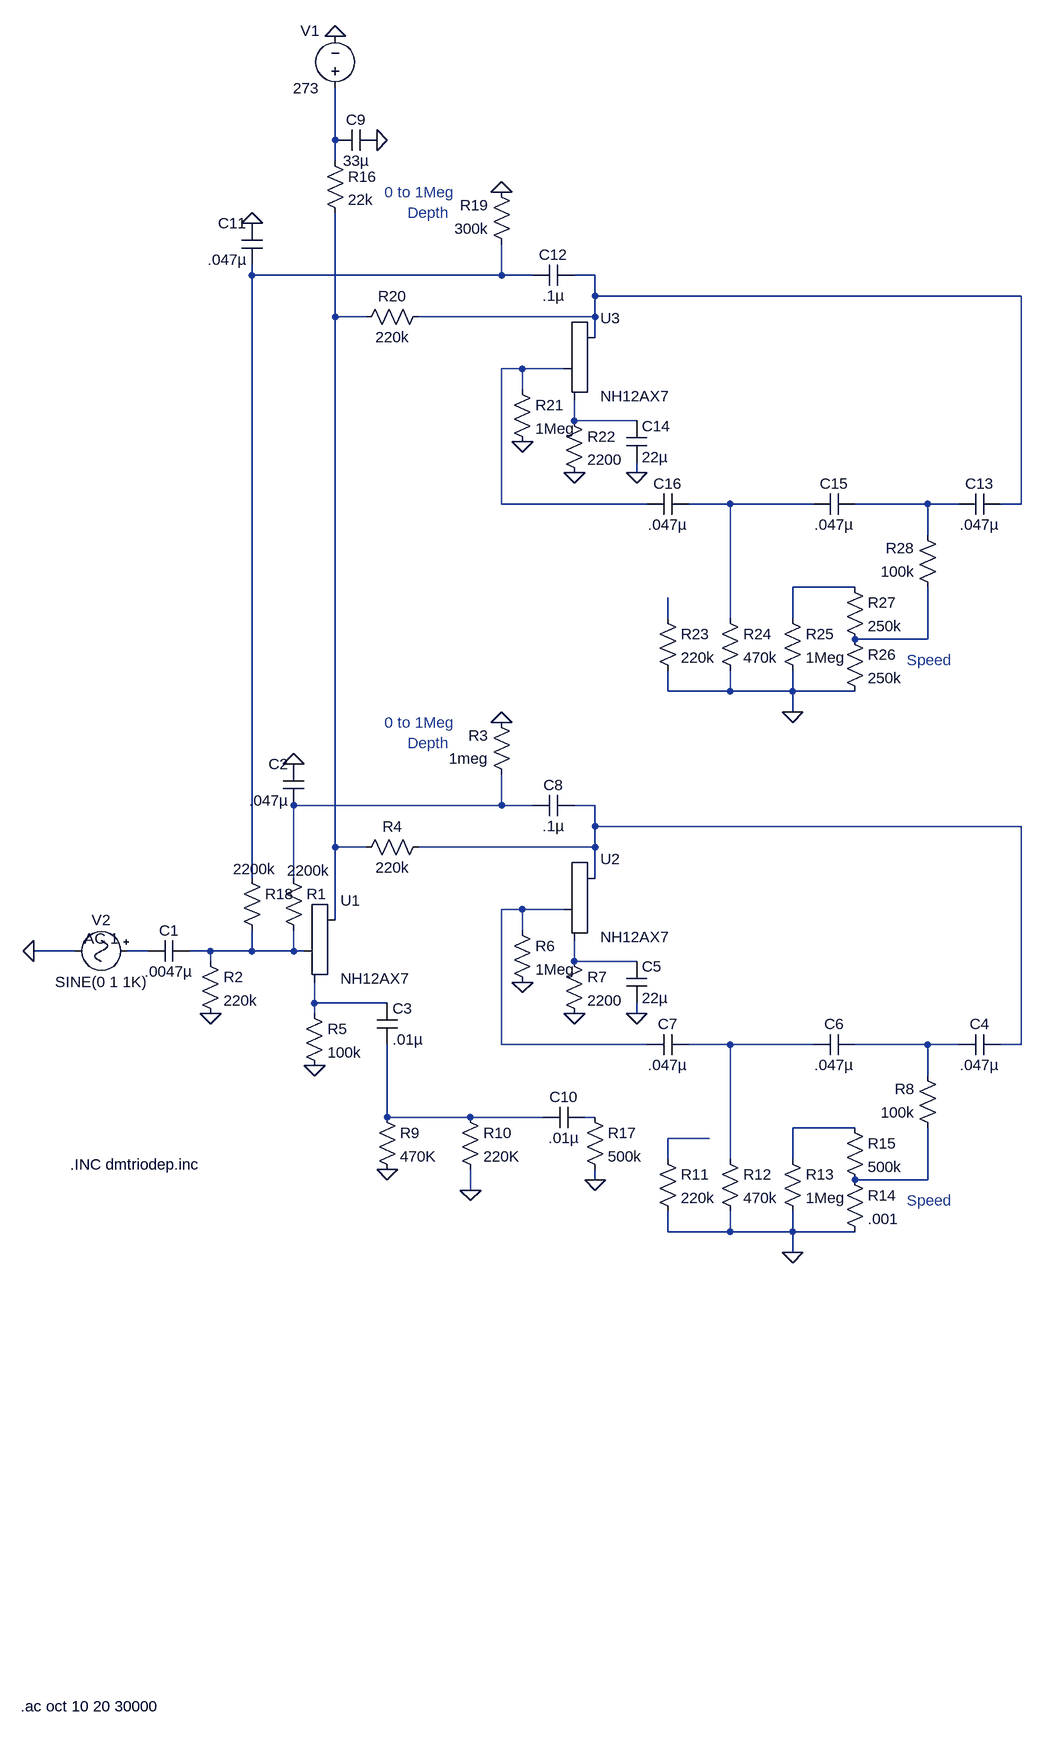
[diagram p0: schematic Double Matchless (spectrum).asc]
Double Matchless (spectrum).asc, the LTspice schematic file:
Version 4
SHEET 1 880 680
WIRE -1456 -1904 -1456 -1984
WIRE -1456 -1872 -1456 -1904
WIRE -1584 -1696 -1584 -1712
WIRE -1200 -1696 -1200 -1744
WIRE -1200 -1696 -1584 -1696
WIRE -1152 -1696 -1200 -1696
WIRE -1056 -1696 -1088 -1696
WIRE -1056 -1664 -1056 -1696
WIRE -400 -1664 -1056 -1664
WIRE -1456 -1632 -1456 -1792
WIRE -1408 -1632 -1456 -1632
WIRE -1056 -1632 -1056 -1664
WIRE -1056 -1632 -1328 -1632
WIRE -1056 -1600 -1056 -1632
WIRE -1168 -1552 -1200 -1552
WIRE -1104 -1552 -1168 -1552
WIRE -1168 -1520 -1168 -1552
WIRE -1088 -1472 -1088 -1504
WIRE -992 -1472 -1088 -1472
WIRE -992 -1392 -992 -1408
WIRE -1200 -1344 -1200 -1552
WIRE -976 -1344 -1200 -1344
WIRE -848 -1344 -912 -1344
WIRE -720 -1344 -848 -1344
WIRE -544 -1344 -656 -1344
WIRE -496 -1344 -544 -1344
WIRE -400 -1344 -400 -1664
WIRE -400 -1344 -432 -1344
WIRE -544 -1296 -544 -1344
WIRE -656 -1216 -752 -1216
WIRE -944 -1168 -944 -1200
WIRE -848 -1168 -848 -1344
WIRE -752 -1168 -752 -1216
WIRE -544 -1136 -544 -1216
WIRE -544 -1136 -656 -1136
WIRE -944 -1056 -944 -1088
WIRE -848 -1056 -848 -1088
WIRE -848 -1056 -944 -1056
WIRE -752 -1056 -752 -1088
WIRE -752 -1056 -848 -1056
WIRE -656 -1056 -752 -1056
WIRE -752 -1024 -752 -1056
WIRE -1200 -880 -1200 -928
WIRE -1200 -880 -1520 -880
WIRE -1152 -880 -1200 -880
WIRE -1056 -880 -1088 -880
WIRE -1056 -848 -1056 -880
WIRE -400 -848 -1056 -848
WIRE -1456 -816 -1456 -1632
WIRE -1408 -816 -1456 -816
WIRE -1056 -816 -1056 -848
WIRE -1056 -816 -1328 -816
WIRE -1584 -768 -1584 -1696
WIRE -1520 -768 -1520 -880
WIRE -1056 -768 -1056 -816
WIRE -1168 -720 -1200 -720
WIRE -1104 -720 -1168 -720
WIRE -1456 -704 -1456 -816
WIRE -1168 -688 -1168 -720
WIRE -1856 -656 -1920 -656
WIRE -1744 -656 -1776 -656
WIRE -1648 -656 -1680 -656
WIRE -1584 -656 -1584 -688
WIRE -1584 -656 -1648 -656
WIRE -1520 -656 -1520 -688
WIRE -1520 -656 -1584 -656
WIRE -1504 -656 -1520 -656
WIRE -1648 -640 -1648 -656
WIRE -1088 -640 -1088 -672
WIRE -992 -640 -1088 -640
WIRE -1488 -576 -1488 -608
WIRE -1376 -576 -1488 -576
WIRE -1488 -560 -1488 -576
WIRE -992 -560 -992 -576
WIRE -1200 -512 -1200 -720
WIRE -976 -512 -1200 -512
WIRE -848 -512 -912 -512
WIRE -720 -512 -848 -512
WIRE -544 -512 -656 -512
WIRE -496 -512 -544 -512
WIRE -400 -512 -400 -848
WIRE -400 -512 -432 -512
WIRE -544 -464 -544 -512
WIRE -1376 -400 -1376 -512
WIRE -1248 -400 -1376 -400
WIRE -1136 -400 -1248 -400
WIRE -1056 -400 -1072 -400
WIRE -656 -384 -752 -384
WIRE -880 -368 -944 -368
WIRE -944 -336 -944 -368
WIRE -848 -336 -848 -512
WIRE -752 -336 -752 -384
WIRE -1056 -304 -1056 -320
WIRE -544 -304 -544 -384
WIRE -544 -304 -656 -304
WIRE -1248 -288 -1248 -320
WIRE -944 -224 -944 -256
WIRE -848 -224 -848 -256
WIRE -848 -224 -944 -224
WIRE -752 -224 -752 -256
WIRE -752 -224 -848 -224
WIRE -656 -224 -752 -224
WIRE -752 -192 -752 -224
FLAG -1456 -2064 0
FLAG -1648 -560 0
FLAG -1520 -944 0
FLAG -1200 -1008 0
FLAG -1488 -480 0
FLAG -992 -560 0
FLAG -1088 -560 0
FLAG -1376 -320 0
FLAG -1248 -288 0
FLAG -1168 -608 0
FLAG -1920 -656 0
FLAG -1392 -1904 0
FLAG -752 -192 0
FLAG -1056 -304 0
FLAG -1584 -1776 0
FLAG -1200 -1824 0
FLAG -992 -1392 0
FLAG -1088 -1392 0
FLAG -1168 -1440 0
FLAG -752 -1024 0
SYMBOL voltage -1456 -1968 R180
WINDOW 0 24 104 Left 0
WINDOW 3 24 16 Left 0
WINDOW 123 0 0 Left 0
WINDOW 39 0 0 Left 0
SYMATTR InstName V1
SYMATTR Value 273
SYMBOL cap -1680 -672 R90
WINDOW 0 0 32 VBottom 0
WINDOW 3 32 32 VTop 0
SYMATTR InstName C1
SYMATTR Value .0047µ
SYMBOL res -1536 -784 R0
WINDOW 3 6 4 Left 0
SYMATTR Value 2200k
SYMATTR InstName R1
SYMBOL res -1664 -656 R0
SYMATTR InstName R2
SYMATTR Value 220k
SYMBOL cap -1504 -880 R180
WINDOW 0 24 64 Left 0
WINDOW 3 24 8 Left 0
SYMATTR InstName C2
SYMATTR Value .047µ
SYMBOL res -1184 -912 R180
WINDOW 0 36 76 Left 0
WINDOW 3 36 40 Left 0
SYMATTR InstName R3
SYMATTR Value 1meg
SYMBOL Misc\\triode -1456 -656 R0
SYMATTR InstName U1
SYMATTR Value NH12AX7
SYMBOL res -1312 -832 R90
WINDOW 0 0 56 VBottom 0
WINDOW 3 32 56 VTop 0
SYMATTR InstName R4
SYMATTR Value 220k
SYMBOL res -1504 -576 R0
SYMATTR InstName R5
SYMATTR Value 100k
SYMBOL cap -1392 -576 R0
SYMATTR InstName C3
SYMATTR Value .01µ
SYMBOL Misc\\triode -1056 -720 R0
SYMATTR InstName U2
SYMATTR Value NH12AX7
SYMBOL res -1184 -704 R0
SYMATTR InstName R6
SYMATTR Value 1Meg
SYMBOL cap -432 -528 R90
WINDOW 0 0 32 VBottom 0
WINDOW 3 32 32 VTop 0
SYMATTR InstName C4
SYMATTR Value .047µ
SYMBOL cap -1008 -640 R0
SYMATTR InstName C5
SYMATTR Value 22µ
SYMBOL res -1104 -656 R0
SYMATTR InstName R7
SYMATTR Value 2200
SYMBOL cap -656 -528 R90
WINDOW 0 0 32 VBottom 0
WINDOW 3 32 32 VTop 0
SYMATTR InstName C6
SYMATTR Value .047µ
SYMBOL res -528 -368 R180
WINDOW 0 36 76 Left 0
WINDOW 3 36 40 Left 0
SYMATTR InstName R8
SYMATTR Value 100k
SYMBOL cap -912 -528 R90
WINDOW 0 0 32 VBottom 0
WINDOW 3 32 32 VTop 0
SYMATTR InstName C7
SYMATTR Value .047µ
SYMBOL res -1392 -416 R0
SYMATTR InstName R9
SYMATTR Value 470K
SYMBOL res -1264 -416 R0
SYMATTR InstName R10
SYMATTR Value 220K
SYMBOL res -960 -352 R0
SYMATTR InstName R11
SYMATTR Value 220k
SYMBOL res -864 -352 R0
SYMATTR InstName R12
SYMATTR Value 470k
SYMBOL res -768 -352 R0
SYMATTR InstName R13
SYMATTR Value 1Meg
SYMBOL res -672 -320 R0
SYMATTR InstName R14
SYMATTR Value .001
SYMBOL res -672 -400 R0
SYMATTR InstName R15
SYMATTR Value 500k
SYMBOL cap -1088 -896 R90
WINDOW 0 0 32 VBottom 0
WINDOW 3 32 32 VTop 0
SYMATTR InstName C8
SYMATTR Value .1µ
SYMBOL res -1472 -1888 R0
SYMATTR InstName R16
SYMATTR Value 22k
SYMBOL cap -1392 -1920 R90
WINDOW 0 0 32 VBottom 0
WINDOW 3 32 32 VTop 0
SYMATTR InstName C9
SYMATTR Value 33µ
SYMBOL Misc\\signal -1760 -656 R90
WINDOW 0 -32 56 VBottom 0
WINDOW 3 32 56 VTop 0
WINDOW 123 -4 56 VBottom 0
WINDOW 39 0 0 Left 0
SYMATTR InstName V2
SYMATTR Value2 AC 1
SYMBOL cap -1072 -416 R90
WINDOW 0 0 32 VBottom 0
WINDOW 3 32 32 VTop 0
SYMATTR InstName C10
SYMATTR Value .01µ
SYMBOL res -1072 -416 R0
SYMATTR InstName R17
SYMATTR Value 500k
SYMBOL res -1600 -784 R0
WINDOW 3 -13 2 Left 0
SYMATTR Value 2200k
SYMATTR InstName R18
SYMBOL cap -1568 -1712 R180
WINDOW 0 24 64 Left 0
WINDOW 3 24 8 Left 0
SYMATTR InstName C11
SYMATTR Value .047µ
SYMBOL res -1184 -1728 R180
WINDOW 0 36 76 Left 0
WINDOW 3 36 40 Left 0
SYMATTR InstName R19
SYMATTR Value 300k
SYMBOL res -1312 -1648 R90
WINDOW 0 0 56 VBottom 0
WINDOW 3 32 56 VTop 0
SYMATTR InstName R20
SYMATTR Value 220k
SYMBOL cap -1088 -1712 R90
WINDOW 0 0 32 VBottom 0
WINDOW 3 32 32 VTop 0
SYMATTR InstName C12
SYMATTR Value .1µ
SYMBOL Misc\\triode -1056 -1552 R0
SYMATTR InstName U3
SYMATTR Value NH12AX7
SYMBOL res -1184 -1536 R0
SYMATTR InstName R21
SYMATTR Value 1Meg
SYMBOL cap -432 -1360 R90
WINDOW 0 0 32 VBottom 0
WINDOW 3 32 32 VTop 0
SYMATTR InstName C13
SYMATTR Value .047µ
SYMBOL cap -1008 -1472 R0
SYMATTR InstName C14
SYMATTR Value 22µ
SYMBOL res -1104 -1488 R0
SYMATTR InstName R22
SYMATTR Value 2200
SYMBOL cap -656 -1360 R90
WINDOW 0 0 32 VBottom 0
WINDOW 3 32 32 VTop 0
SYMATTR InstName C15
SYMATTR Value .047µ
SYMBOL cap -912 -1360 R90
WINDOW 0 0 32 VBottom 0
WINDOW 3 32 32 VTop 0
SYMATTR InstName C16
SYMATTR Value .047µ
SYMBOL res -960 -1184 R0
SYMATTR InstName R23
SYMATTR Value 220k
SYMBOL res -864 -1184 R0
SYMATTR InstName R24
SYMATTR Value 470k
SYMBOL res -768 -1184 R0
SYMATTR InstName R25
SYMATTR Value 1Meg
SYMBOL res -672 -1152 R0
SYMATTR InstName R26
SYMATTR Value 250k
SYMBOL res -672 -1232 R0
SYMATTR InstName R27
SYMATTR Value 250k
SYMBOL res -528 -1200 R180
WINDOW 0 36 76 Left 0
WINDOW 3 36 40 Left 0
SYMATTR InstName R28
SYMATTR Value 100k
TEXT -1280 -976 Right 0 ;Depth
TEXT -576 -272 Left 0 ;Speed
TEXT -1864 -328 Left 0 !.INC dmtriodep.inc
TEXT -1272 -1008 Right 0 ;0 to 1Meg
TEXT -1280 -1792 Right 0 ;Depth
TEXT -1272 -1824 Right 0 ;0 to 1Meg
TEXT -576 -1104 Left 0 ;Speed
TEXT -1940 506 Left 0 !.ac oct 10 20 30000

The netlist it stands for:
* Double Matchless (spectrum).asc
V1 N001 0 273
C1 N016 N015 .0047µ
R1 N012 N016 2200k
R2 N016 0 220k
C2 N012 0 .047µ
R3 N012 0 1meg
XU1 N004 N016 N018 NH12AX7
R4 N013 N004 220k
R5 N018 0 100k
C3 N018 N021 .01µ
XU2 N013 N014 N017 NH12AX7
R6 N014 0 1Meg
C4 N013 N020 .047µ
C5 N017 0 22µ
R7 N017 0 2200
C6 N020 N019 .047µ
R8 N025 N020 100k
C7 N019 N014 .047µ
R9 N021 0 470K
R10 N021 0 220K
R11 N024 0 220k
R12 N019 0 470k
R13 N023 0 1Meg
R14 N025 0 .001
R15 N023 N025 500k
C8 N013 N012 .1µ
R16 N001 N004 22k
C9 0 N001 33µ
V2 N015 0 SINE(0 1 1K) AC 1
C10 N022 N021 .01µ
R17 N022 0 500k
R18 N002 N016 2200k
C11 N002 0 .047µ
R19 N002 0 300k
R20 N003 N004 220k
C12 N003 N002 .1µ
XU3 N003 N005 N006 NH12AX7
R21 N005 0 1Meg
C13 N003 N008 .047µ
C14 N006 0 22µ
R22 N006 0 2200
C15 N008 N007 .047µ
C16 N007 N005 .047µ
R23 N010 0 220k
R24 N007 0 470k
R25 N009 0 1Meg
R26 N011 0 250k
R27 N009 N011 250k
R28 N011 N008 100k
* Depth
* Speed
.INC dmtriodep.inc
* 0 to 1Meg
* Depth
* 0 to 1Meg
* Speed
.ac oct 10 20 30000
.backanno
.end